# Altium schematic sheet vco.SchDoc
size A
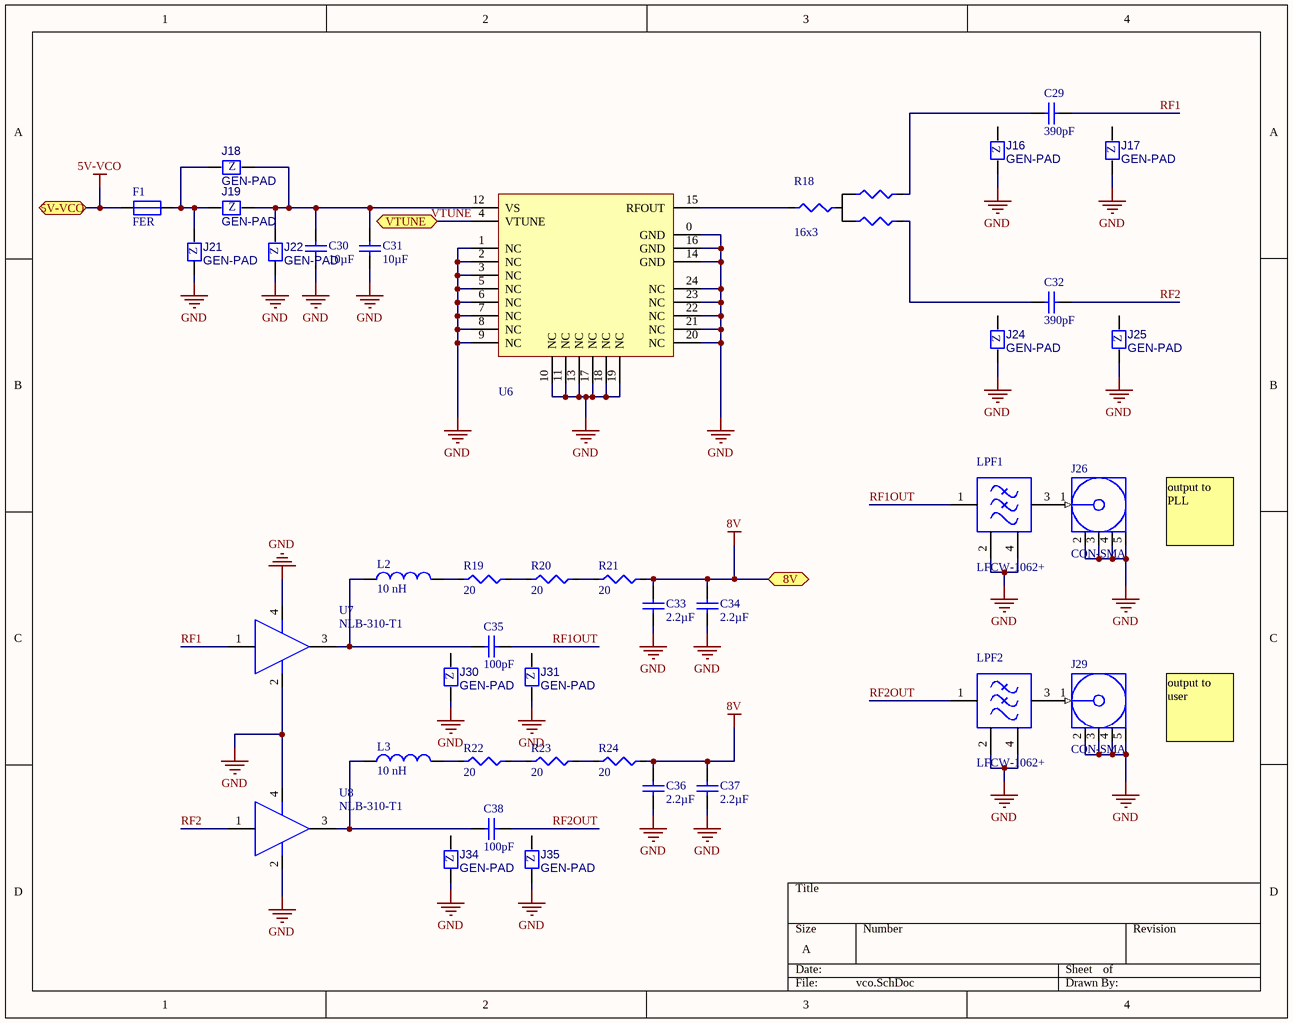
[diagram p0: vco.SchDoc]

## Parts
C29  390pF  [0402-RF-0.55mm]
C30  10µF  [0402-0.55mm]
C31  10µF  [0402-0.55mm]
C32  390pF  [0402-RF-0.55mm]
C33  2.2µF  [0402-0.55mm]
C34  2.2µF  [0402-0.55mm]
C35  100pF  [0402-RF-0.55mm]
C36  2.2µF  [0402-0.55mm]
C37  2.2µF  [0402-0.55mm]
C38  100pF  [0402-RF-0.55mm]
F1  FER  [0603-0.8mm]
J16  GEN-PAD  [0402-DNP]
J17  GEN-PAD  [0402-DNP]
J18  GEN-PAD  [0805-DNP]
J19  GEN-PAD  [0805-DNP]
J21  GEN-PAD  [0805-DNP]
J22  GEN-PAD  [0805-DNP]
J24  GEN-PAD  [0402-DNP]
J25  GEN-PAD  [0402-DNP]
J26  CON-SMA  [CON-COAX]
J29  CON-SMA  [CON-COAX]
J30  GEN-PAD  [0402-DNP]
J31  GEN-PAD  [0402-DNP]
J34  GEN-PAD  [0402-DNP]
J35  GEN-PAD  [0402-DNP]
L2  value 10 nH  [L0603-0.8mm]  (hidden comment: L)
L3  value 10 nH  [L0603-0.8mm]  (hidden comment: L)
LPF1  LFCW-1062+  [LPF-0603-0.8mm]
LPF2  LFCW-1062+  [LPF-0603-0.8mm]
R18  16x3  [0402-SPLIT-3-0.55mm]
R19  20  [0805-0.45MM]
R20  20  [0805-0.45MM]
R21  20  [0805-0.45MM]
R22  20  [0805-0.45MM]
R23  20  [0805-0.45MM]
R24  20  [0805-0.45MM]
U6  RFVC1801  [QFN-24-(4x4)]  (value not drawn)
U7  NLB-310-T1  [SOT-86]
U8  NLB-310-T1  [SOT-86]

## Ports
5V-VCO, 8V, VTUNE

## Nets
5V-VCO: F1.2 ; port 5V-VCO
8V: C33.2 C34.2 C36.2 C37.2 R21.2 R24.2 ; port 8V
GND: C30.1 C31.1 C33.1 C34.1 C36.1 C37.1 J16.2 J17.2 J21.2 J22.2 J24.2 J25.2 J26.2(GND) J26.3(GND) J26.4(GND) J26.5(GND) J29.2(GND) J29.3(GND) J29.4(GND) J29.5(GND) J30.2 J31.2 J34.2 J35.2 LPF1.2(GND) LPF1.4(GND) LPF2.2(GND) LPF2.4(GND) U6.0(GND) U6.1(NC) U6.2(NC) U6.3(NC) U6.5(NC) U6.6(NC) U6.7(NC) U6.8(NC) U6.9(NC) U6.10(NC) U6.11(NC) U6.13(NC) U6.14(GND) U6.16(GND) U6.17(NC) U6.18(NC) U6.19(NC) U6.20(NC) U6.21(NC) U6.22(NC) U6.23(NC) U6.24(NC) U7.2(GND) U7.4(GND) U8.2(GND) U8.4(GND)
RF1: C29.2 U7.1(RFIN)
RF1OUT: C35.2 LPF1.1(RF-IN)
RF2: C32.2 U8.1(RFIN)
RF2OUT: C38.2 LPF2.1(RF-IN)
VTUNE: U6.4(VTUNE) ; port VTUNE
NetC29_1: C29.1 R18.2
NetC30_2: C30.2 C31.2 J18.1 J19.1 J22.1 U6.12(VS)
NetC32_1: C32.1 R18.3
NetC35_1: C35.1 L2.1 U7.3(RFOUT)
NetC38_1: C38.1 L3.1 U8.3(RFOUT)
NetF1_1: F1.1 J18.2 J19.2 J21.1
NetJ26_1: J26.1(Signal) LPF1.3(RF-OUT)
NetJ29_1: J29.1(Signal) LPF2.3(RF-OUT)
NetL2_2: L2.2 R19.1
NetL3_2: L3.2 R22.1
NetR18_1: R18.1 U6.15(RFOUT)
NetR19_2: R19.2 R20.1
NetR20_2: R20.2 R21.1
NetR22_2: R22.2 R23.1
NetR23_2: R23.2 R24.1

Not connected (* = marked no-connect by the designer): J16 1; J17 1; J24 1; J25 1; J30 1; J31 1; J34 1; J35 1

## Notes on the sheet
- (near J26) output to PLL
- (near J29) output to user
- Labels drawn without touching a wire or pin: VTUNE
- (in symbol EE-GEN-00001) Z
- (in symbol EE-GEN-00002) Z

## Library data of the parts
C29 C32 = EE-CAP-00016: Capacitor; Part Description: CAP CER 390PF 50V 10% X7R 0402; Manufacturer: Murata; Manufacturer Part Number: GRM155R71H391KA01D; Record Number: 16; Voltage: 50V; PackageDescription: Chip Capacitor; EE Part Number: EE-CAP-00016; Value: 390pF; Datasheet Link: GRM155R71H391KA01D; Supplier 1: DigiKey; Supplier Part Number 1: 490-3249-1-ND; Supplier Link 1: DigiKey; Supplier 2: Mouser; Supplier Part Number 2: 81-GRM155R71H391KA1D; Supplier Link 2: Mouser
C30 C31 = EE-CAP-00009: Capacitor; Part Description: CAP CER 10UF 10V 20% X5R 0402; Manufacturer: Samsung; Manufacturer Part Number: CL05A106MP5NUNC; Record Number: 9; Voltage: 10V; PackageDescription: Chip Capacitor; EE Part Number: EE-CAP-00009; Value: 10µF; Datasheet Link: CL05A106MP5NUNC; Supplier 1: DigiKey; Supplier Part Number 1: 1276-1450-1-ND; Supplier Link 1: DigiKey
C33 C34 C36 C37 = EE-CAP-00003: Capacitor; Part Description: CAP CER 2.2UF 35V 10% X5R 0402; Manufacturer: TDK; Manufacturer Part Number: C1005X5R1V225K050BC; Record Number: 3; Voltage: 35V; PackageDescription: Chip Capacitor; EE Part Number: EE-CAP-00003; Value: 2.2µF; Datasheet Link: C1005X5R1V225K050BC; Supplier 1: DigiKey; Supplier Part Number 1: 445-9028-1-ND; Supplier Link 1: DigiKey; Supplier 2: Mouser; Supplier Part Number 2: 810-C1005X5R1V225K; Supplier Link 2: Mouser
C35 C38 = EE-CAP-00017: Capacitor; Part Description: CAP CER 100PF 25V 1% NP0 0402; Manufacturer: Kemet; Manufacturer Part Number: CBR04C101F3GAC; Record Number: 17; Voltage: 25V; PackageDescription: Chip Capacitor; EE Part Number: EE-CAP-00017; Value: 100pF; Datasheet Link: CBR04C101F3GAC; Supplier 1: DigiKey; Supplier Part Number 1: 399-11246-1-ND; Supplier Link 1: DigiKey; Supplier 2: Mouser; Supplier Part Number 2: 80-CBR04C101F3GAC; Supplier Link 2: Mouser
F1 = EE-FER-00001: Part Description: FERRITE CHIP SIGNAL 2200 OHM SMD; Manufacturer: Laird-Signal; Manufacturer Part Number: HZ0603A222R-10; Record Number: 1; Value: 2.2k Ohms; Resistance (mOhms): 1500; Current (A): 100mA; Impedance @ 100MHz: 2200; EE Part Number: EE-FER-00001; Datasheet Link: HZ0603A222R-10; Supplier 1: DigiKey; Supplier Part Number 1: 240-2377-1-ND; Supplier Link 1: DigiKey; Supplier 2: Mouser; Supplier Part Number 2: 875-HZ0603A222R-10; Supplier Link 2: Mouser
J16 J17 J24 J25 J30 J31 J34 J35 = EE-GEN-00002: Generic Component; Part Description: 0402 Generic Comp; Record Number: 2; EE Part Number: EE-GEN-00002; Value: GEN-0402; Pins: 2; Manufacturer: N/A; Manufacturer Part Number: N/A; Supplier 1: N/A; Supplier Part Number 1: N/A
J18 J19 J21 J22 = EE-GEN-00001: Generic Component; Part Description: 0805 Generic Comp; Record Number: 1; EE Part Number: EE-GEN-00001; Value: GEN-0805; Pins: 2; Manufacturer: N/A; Manufacturer Part Number: N/A; Supplier 1: N/A; Supplier Part Number 1: N/A
J26 J29 = EE-CON-00001: Part Description: SMA Jack, 1.73mm (.068) Board Clearance, End Launched, DC-26.5 GHz, Gold plated.; Manufacturer: East Coast Microwave; Manufacturer Part Number: PSF-S01-008; Record Number: 1; Value: SMA-1.73mm; EE Part Number: EE-CON-00001; Pins: 5; Datasheet Link: PSF-S01-008; Supplier 1: ECM; Supplier Part Number 1: PSF-S01-008; Supplier Link 1: ECM
L2 L3 = 800mA: Inductor; EE Part Number: EE-L-00001; Part Description: INDUCTOR 10NH 800MA; Manufacturer: Murata; Manufacturer Part Number: LQW18AN10NG10D; Record Number: 1; Current: 800mA; Tolerance: ±2%; Resistance: 58 mOhm Max; Datasheet Link: LQW18AN10NG10D; Supplier 1: DigiKey; Supplier Part Number 1: 490-6857-1-ND; Supplier Link 1: DigiKey; Supplier 2: Mouser; Supplier Part Number 2: 81-LQW18AN10NG10D; Supplier Link 2: Mouser
LPF1 LPF2 = EE-FILTER-00001: Part Description: LTCC Low Pass Filter; Manufacturer: Mini-Circuits; Record Number: 1; Frequency Range: DC to 10.6 GHz; Impedance: 50 Ω; Power: 4W; EE Part Number: EE-FILTER-00001; Value: LFCW-1062+; Package: LPF-0603-0.8mm; Manufacturer Part Number: LFCW-1062+; Datasheet Link: LFCW-1062+; Supplier 1: Mini-Circuits; Supplier Part Number 1: LFCW-1062+; Supplier Link 1: Mini-Circuits
R18 = EE-RES-00003: Part Description: Resistor Splitter; Record Number: 3; Tolerance: ±1%; Power: 0.1W, 1/10W; EE Part Number: EE-RES-00003; Value: 16x3; Manufacturer: N/A; Manufacturer Part Number: N/A; Datasheet Link: N/A; Supplier 1: N/A; Supplier Part Number 1: N/A; Supplier Link 1: N/A
R19-R24 = EM-RES-01452: Part Description: RES 20.0 OHM 1/8W 1% 0805 SMD; Manufacturer: Vishay; Manufacturer Part Number: CRCW080520R0FKEA; Record Number: 1452; Tolerance: 1%; Power: 0.125W; EM Part Number: EM-RES-01452; Value: 20; Supplier 1: Digi-Key; Supplier Part Number 1: 541-20.0CCT-ND
U6 = QFN-24-(4x4): EE Part Number: EE-MISC-00001; Part Description: IC MMIC VCO BUF AMP 24-QFN; Manufacturer: RFMD; Record Number: 1; Value: RFVC1801SQ; Voltage: 5.5V; Package: 24-QFN-EP (4x4); Manufacturer Part Number: RFVC1801SQ; Datasheet: RFVC1801SQ; Supplier 1: RFMD; Supplier Part Number 1: RFVC1801SQ; Supplier Link 1: RFMD
U7 U8 = SOT-86: EE Part Number: EE-OPAMP-00001; Part Description: IC AMP MMIC GAAS 10GHZ 4-MICROX; Manufacturer: RFMD; Record Number: 1; Frequency Range: 0Hz ~ 10GHz; Voltage: 4.4 V ~ 4.8 V; Drive Current: 50mA; Value: NLB-310-T1; Channels: 1; Package: SOT-86; Manufacturer Part Number: NLB-310-T1; Datasheet Link: NLB-310-T1; Supplier 1: DigiKey; Supplier Part Number 1: NLB-310-T1; Supplier Link 1: DigiKey